# EAGLE design pwr-driver (EAGLE 7.1.0)
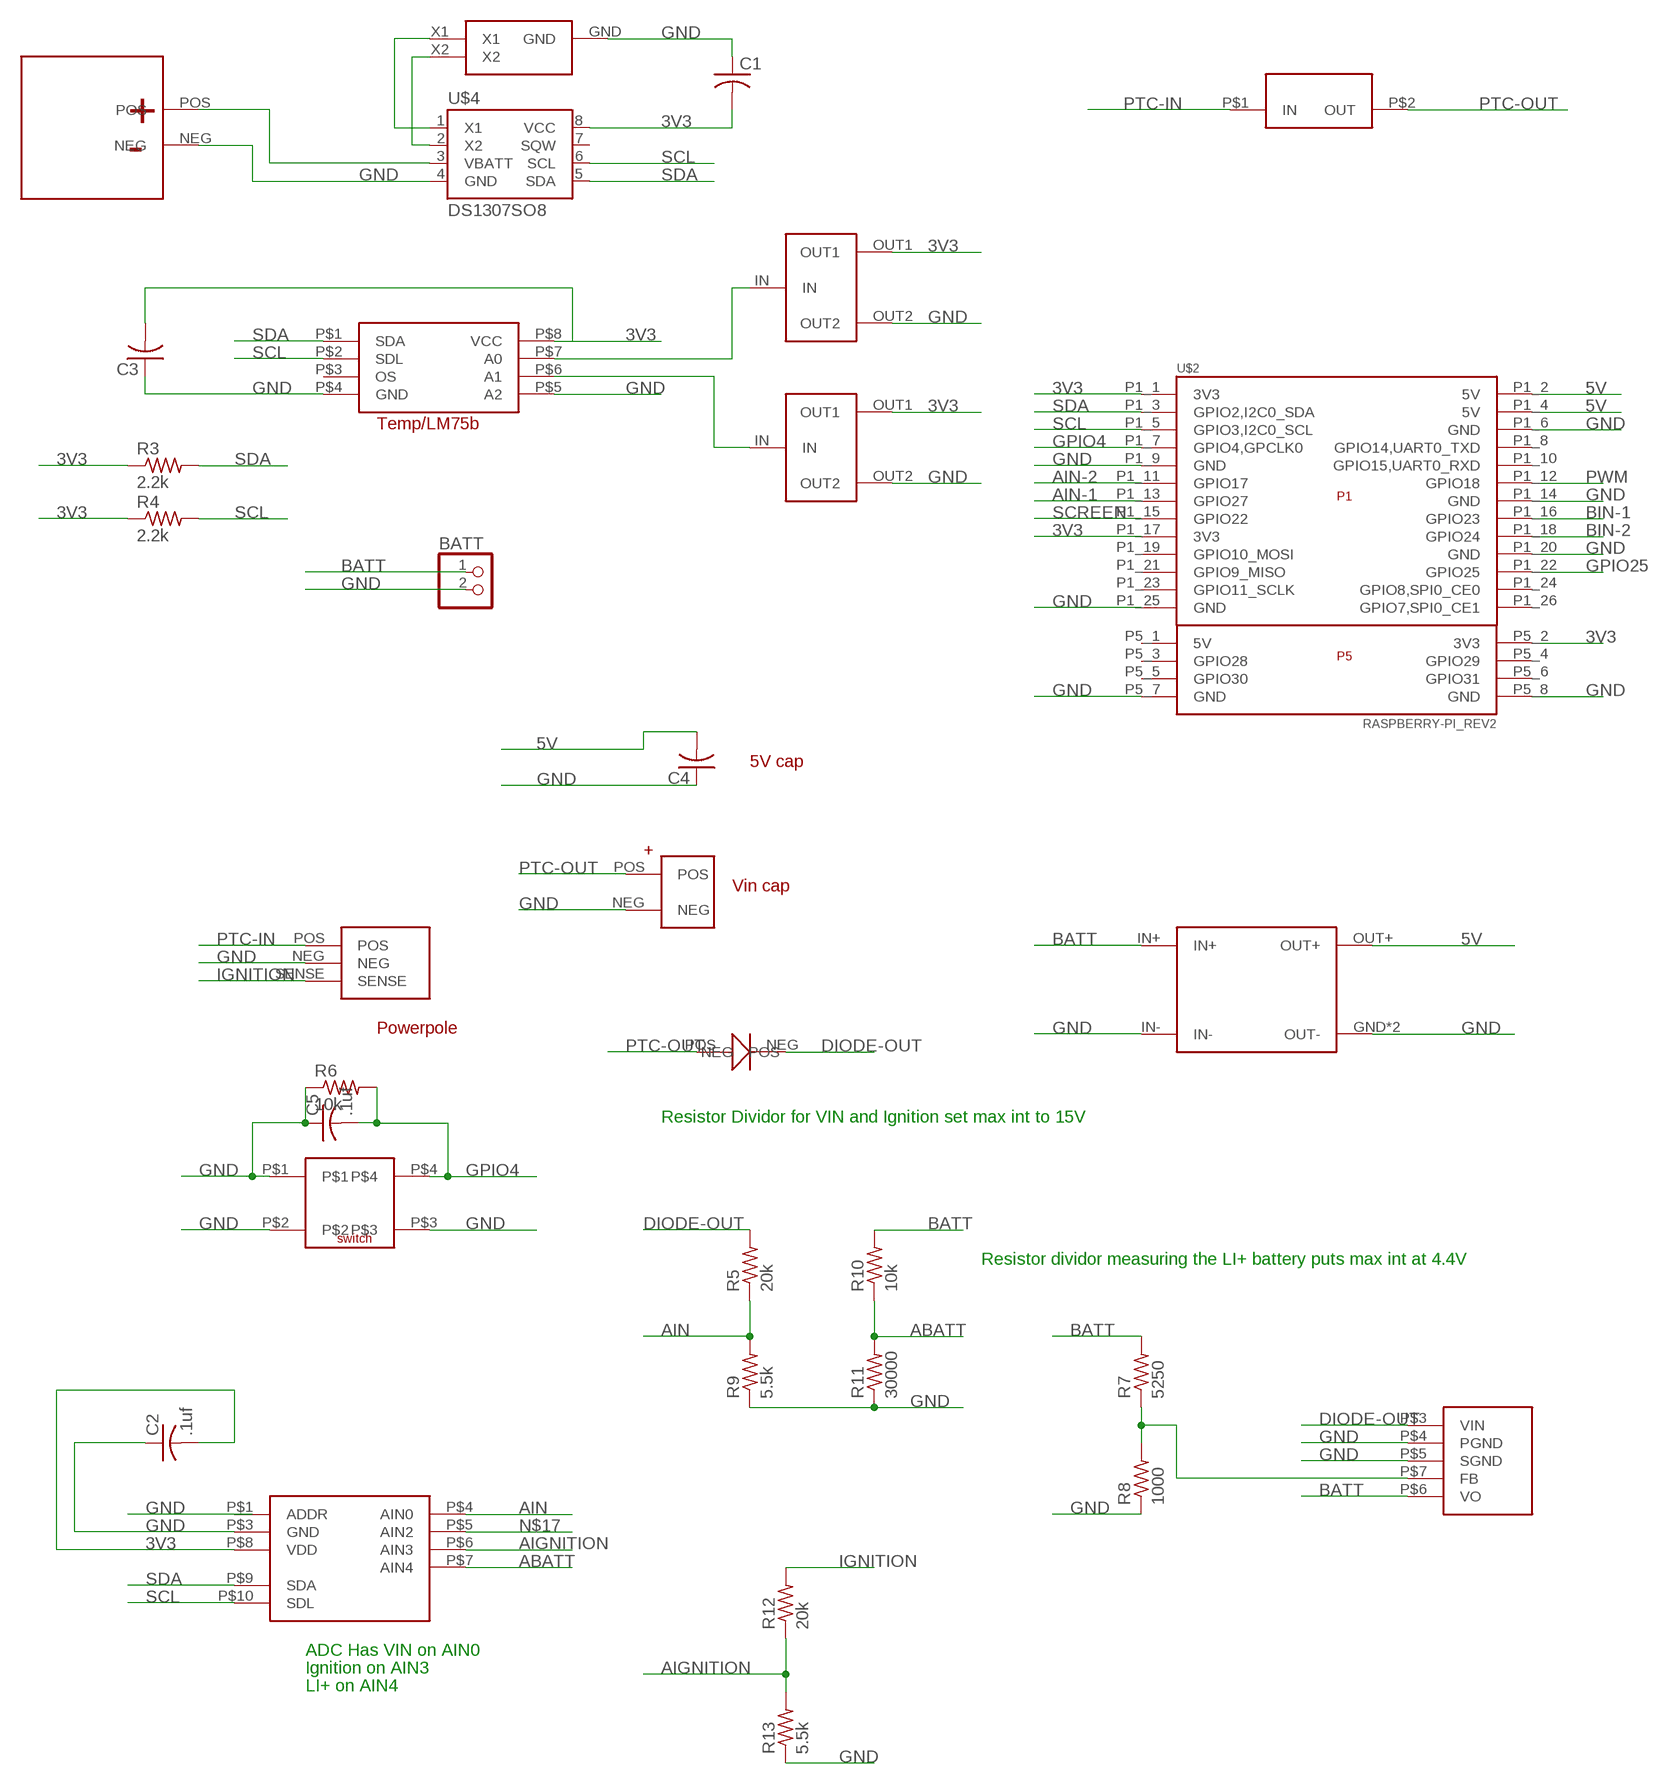
[diagram p0: schematic, sheet 1]

## Parts
BATT  PINHD-1X2  [1X02]
C1  C-USC0805K  [C0805K]
C2  .1uf  C-USC0603  [C0603]
C3  C-USC0805  [C0805]
C4  C-USC3216  [C3216]
C5  .1uf  C-USC0603  [C0603]
R3  2.2k  R-US_R0603  [R0603]
R4  2.2k  R-US_R0603  [R0603]
R5  20k  R-US_R0603  [R0603]
R6  10k  R-US_R0603  [R0603]
R7  5250  R-US_R0603  [R0603]
R8  1000  R-US_R0603  [R0603]
R9  5.5k  R-US_R0603  [R0603]
R10  10k  R-US_R0603  [R0603]
R11  30000  R-US_R0603  [R0603]
R12  20k  R-US_R0603  [R0603]
R13  5.5k  R-US_R0603  [R0603]
U$1  MPM80  [TO-220-8L]
U$2  RASPBERRY-PI_REV2  [RASPBERRY-PI_REV2]
U$3  STEP-UP-FROM-AMAZON  [STEP-UP-FROM-AMAZON]
U$4  DS1307SO8  [SO08]
U$5  BATTERY-MS518SE  [BATTERY-MS518SE-FL35E]
U$6  AB26T-CRYSTAL  [AB26T-CRYSTAL]
U$7  POWERPOLE-WITH-SENSE  [POWERPOLE-3]
U$8  PTC  [PTC-0ZRM0100FF1E]
U$9  LM75-BDP-TEMP  [TSSOP8]
U$10  ADS1013  [MSOP-10]
U$11  CAP-SMD-100U  [CAP-100UF-SMD]
U$12  0805-3-WAY  [0805-3-WAY]
U$13  0805-3-WAY  [0805-3-WAY]
U$14  MICRO-SWITCH  [BUTTON-MICRO-SWITCH]
U$15  DIODE-403  [403]

## Nets
3V3: C1.2 C2.2 C3.2 R3.1 R4.1 U$2.P1_1(3V3) U$2.P1_17(3V3) U$2.P5_2(3V3) U$4.8(VCC) U$9.P$8(VCC) U$10.P$8(VDD) U$12.OUT1 U$13.OUT1
5V: C4.2 U$2.P1_2(5V) U$2.P1_4(5V) U$3.OUT+
ABATT: R10.1 R11.2 U$10.P$7(AIN4)
AIGNITION: R12.1 R13.2 U$10.P$6(AIN3)
AIN: R5.1 R9.2 U$10.P$4(AIN0)
AIN-1: U$2.P1_13(GPIO27)
AIN-2: U$2.P1_11(GPIO17)
BATT: BATT.1 R7.2 R10.2 U$1.P$6(VO) U$3.IN+
BIN-1: U$2.P1_16(GPIO23)
BIN-2: U$2.P1_18(GPIO24)
DIODE-OUT: R5.2 U$1.P$3(VIN) U$15.NEG
GND: BATT.2 C1.1 C2.1 C3.1 C4.1 C5.1 R6.1 R8.1 R9.1 R11.1 R13.1 U$1.P$4(PGND) U$1.P$5(SGND) U$2.P1_6(GND) U$2.P1_9(GND) U$2.P1_14(GND) U$2.P1_20(GND) U$2.P1_25(GND) U$2.P5_7(GND) U$2.P5_8(GND) U$3.GND(OUT-) U$3.IN- U$3.OUT- U$4.4(GND) U$5.NEG U$6.GND U$7.NEG U$9.P$4(GND) U$9.P$5(A2) U$10.P$3(GND) U$11.NEG U$12.OUT2 U$13.OUT2 U$14.P$1 U$14.P$2 U$14.P$3
GPIO4: C5.2 R6.2 U$2.P1_7(GPIO4,GPCLK0) U$14.P$4
GPIO25: U$2.P1_22(GPIO25)
IGNITION: R12.2 U$7.SENSE
N$1: U$4.3(VBATT) U$5.POS
N$2: U$4.2(X2) U$6.X2
N$3: U$4.1(X1) U$6.X1
N$4: R7.1 R8.2 U$1.P$7(FB)
N$7: U$9.P$7(A0) U$12.IN
N$9: U$9.P$6(A1) U$13.IN
N$17: U$10.P$5(AIN2)
PTC-IN: U$7.POS U$8.P$1(IN)
PTC-OUT: U$8.P$2(OUT) U$11.POS U$15.POS
PWM: U$2.P1_12(GPIO18)
SCL: R4.2 U$2.P1_5(GPIO3,I2C0_SCL) U$4.6(SCL) U$9.P$2(SDL) U$10.P$10(SDL)
SCREEN: U$2.P1_15(GPIO22)
SDA: R3.2 U$2.P1_3(GPIO2,I2C0_SDA) U$4.5(SDA) U$9.P$1(SDA) U$10.P$9(SDA)
Unconnected: U$2.P1_8(GPIO14,UART0_TXD) U$2.P1_10(GPIO15,UART0_RXD) U$2.P1_19(GPIO10_MOSI) U$2.P1_21(GPIO9_MISO) U$2.P1_23(GPIO11_SCLK) U$2.P1_24(GPIO8,SPI0_CE0) U$2.P1_26(GPIO7,SPI0_CE1) U$2.P5_1(5V) U$2.P5_3(GPIO28) U$2.P5_4(GPIO29) U$2.P5_5(GPIO30) U$2.P5_6(GPIO31) U$4.7(SQW) U$9.P$3(OS) U$10.P$1(ADDR)

## Notes on the sheet
- 5V cap
- Vin cap
- Powerpole
- Resistor Dividor for VIN and Ignition set max int to 15V
- Resistor dividor measuring the LI+ battery puts max int at 4.4V
- ADC Has VIN on AIN0
- Ignition on AIN3
- LI+ on AIN4

## Library data of the parts
BATT = pinhead:PINHD-1X2: PIN HEADER
C1-C5 = resistor:C-US: CAPACITOR, American symbol
R3-R13 = resistor:R-US_: RESISTOR, American symbol
U$1 = needed-parts:MPM80
U$2 = RaspberryPi:RASPBERRY-PI_REV2: Raspberry Pi Board <http://www.raspberrypi.org/> Jacques Lagnel V1.0 (beta) 2012 Mateusz Bawaj V1.1 (beta) 2012 Board dimension: Forum 3D model <http://www.raspberrypi.org/forum/general-discussion/mechanical-profile-3d-models?value=3d%20model&type=1&include=1&search=1&ret=all> The GPIO Connector (P1): http://elinux.org/RPi_Low-level_peripherals The GPIO Connector (P5): http://www.raspberrypi-spy.co.uk/2012/09/raspberry-pi-p5-header/
U$3 = needed-parts:STEP-UP-FROM-AMAZON
U$4 = mgregg:DS1307
U$5 = mgregg:BATTERY-MS518SE
U$6 = mgregg:AB26T-CRYSTAL
U$7 = needed-parts:POWERPOLE-WITH-SENSE
U$8 = needed-parts:PTC
U$9 = mgregg:LM75-BDP-TEMP
U$10 = needed-parts:ADS1013
U$11 = mgregg:CAP-SMD-100U: http://www.mouser.com/Search/ProductDetail.aspx?R=VEJ-101M1ETR-0607virtualkey14000000virtualkey140-VEJ101M1ETR0607
U$12 U$13 = mgregg:0805-3-WAY
U$14 = mgregg:MICRO-SWITCH
U$15 = needed-parts:DIODE-403

## Board
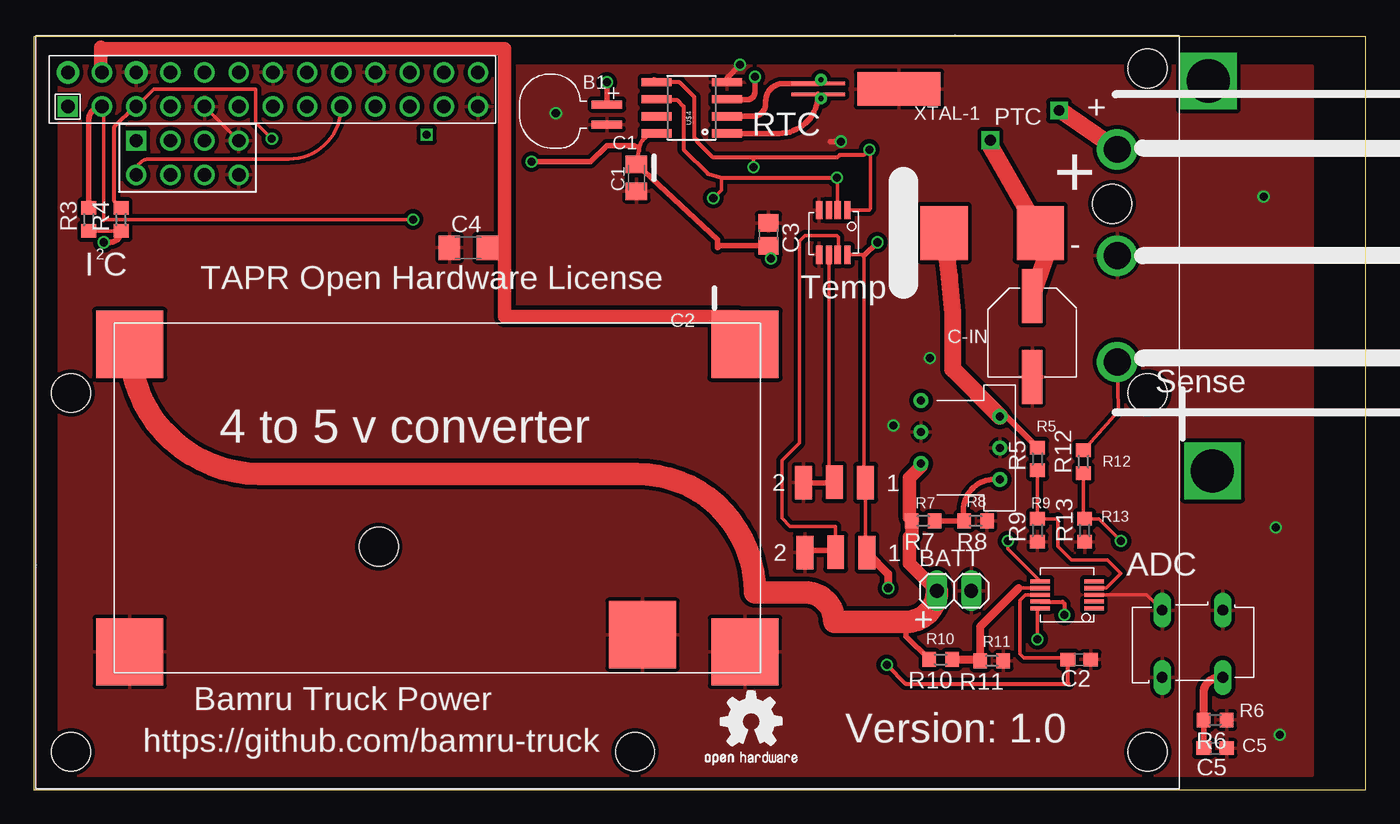
[diagram p1: board, top side]
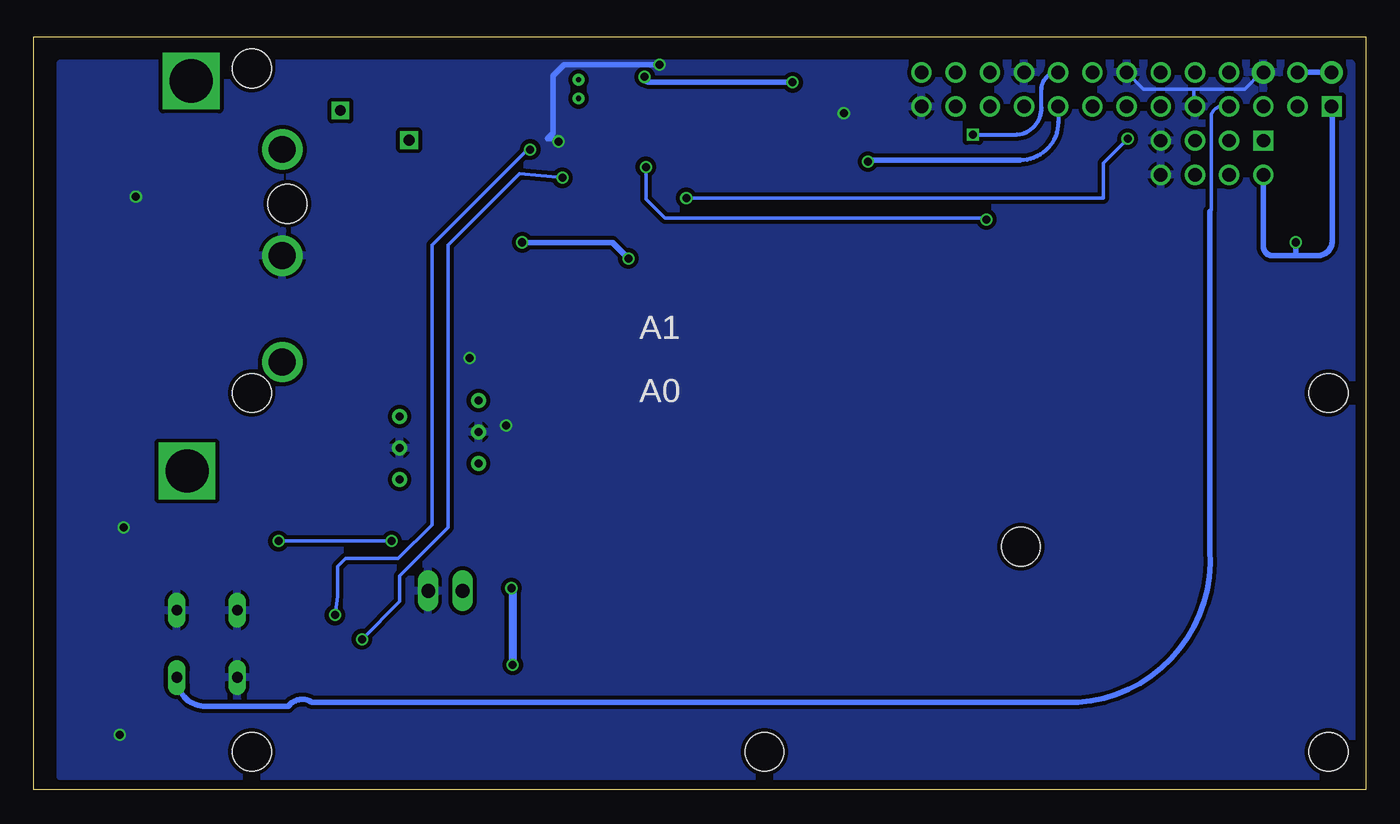
[diagram p2: board, bottom side, seen from below]

Size 99 x 56 mm. Coordinates in mm from the lower left corner, seen from the top.
Outline: 0,0 99,0 99,56 0,56 0,0
Copper layers (1*16): Top 0.035mm / dielectric 1.5mm / Bottom 0.035mm
Design rules "SeeedStudio_2layer_DRU_no_angle_20140221": minimum track width 6mil, minimum drill 12mil, track to track 6mil, track to pad 6mil, pad to pad 6mil, via to via 6mil, smd to smd 0mil, copper to edge 10mil, drill to drill 10mil, minimum pad ring 10mil, minimum via ring 6mil, stop-mask expansion 2mil, vias tented up to drill 100mil, thermal gap 10mil

### Footprints (pad centres in the part's own frame; a part is rotated, then mirrored left to right if it is on the bottom)
1X02 = drill 1.016 long: 1 -1.27,0; 2 1.27,0
C0805K = smd 1.3 x 1.6: 1 -1,0; 2 1,0
C0603 = smd 1.1 x 1: 1 -0.85,0; 2 0.85,0
C0805 = smd 1.3 x 1.5: 1 -0.85,0; 2 0.85,0
C3216 = smd 1.6 x 1.8: 1 -1.4,0; 2 1.4,0
R0603 = smd 1 x 1.1: 1 -0.85,0; 2 0.85,0
TO-220-8L = drill 0.6: P$2 2.34,5.85; P$3 1.17,0; P$4 0,5.85; P$5 -1.17,0; P$6 -2.34,5.85; P$7 -3.51,0
RASPBERRY-PI_REV2 = drill 1 square: P1_1 -41.91,21.59; P5_1 -36.83,19.05 | drill 1 pad 1.676: P1_2 -41.91,24.13; P1_6 -36.83,24.13 | drill 1: P1_3 -39.37,21.59; P1_4 -39.37,24.13; P1_5 -36.83,21.59; P1_7 -34.29,21.59; P1_8 -34.29,24.13; P1_9 -31.75,21.59; P1_10 -31.75,24.13; P1_11 -29.21,21.59; P1_12 -29.21,24.13; P1_13 -26.67,21.59; P1_14 -26.67,24.13; P1_15 -24.13,21.59; P1_16 -24.13,24.13; P1_17 -21.59,21.59; P1_18 -21.59,24.13; P1_19 -19.05,21.59; P1_20 -19.05,24.13; P1_21 -16.51,21.59; P1_22 -16.51,24.13; P1_23 -13.97,21.59; P1_24 -13.97,24.13; P1_25 -11.43,21.59; P1_26 -11.43,24.13; P5_2 -36.83,16.51; P5_3 -34.29,19.05; P5_4 -34.29,16.51; P5_5 -31.75,19.05; P5_6 -31.75,16.51; P5_7 -29.21,19.05; P5_8 -29.21,16.51 | hole 2.9: 35.69,14.365; -18.81,-11.135; -41.67,-26.375; 0.24,-26.375; 38.34,-26.375; 38.34,0.295; 38.34,24.425; -41.67,0.295
STEP-UP-FROM-AMAZON = smd 5 x 5: GND 15.24,-10.16; IN+ -22.86,11.43; IN- -22.86,-11.43; OUT+ 22.86,11.43; OUT- 22.86,-11.43
SO08 = smd 0.61 x 2.21: 1 -1.905,-2.616; 2 -0.635,-2.616; 3 0.635,-2.616; 4 1.905,-2.616; 5 1.905,2.616; 6 0.635,2.616; 7 -0.635,2.616; 8 -1.905,2.616
BATTERY-MS518SE-FL35E = smd 2.25 x 0.6: NEG 5,0.25; POS 5,1.75
AB26T-CRYSTAL = smd 6.2 x 2.5: GND -2,0.4 | drill 0.381: P$1 3.8,1.1; P$2 3.8,-0.3 | smd 4 x 0.25: X1 4,0.8; X2 4,0
POWERPOLE-3 = drill 2: NEG -0.28,3.81; POS -0.28,11.71; SENSE -0.28,-4.09
PTC-0ZRM0100FF1E = drill 0.8 square: P$1 0,0; P$2 5.1,2.2
TSSOP8 = smd 1.35 x 0.45: P$1 0,1.375; P$2 0,0.65; P$3 0,0; P$4 0,-0.725; P$5 3.325,-0.725; P$6 3.325,0; P$7 3.325,0.65; P$8 3.325,1.375
MSOP-10 = smd 0.3 x 1.45: P$1 0,-2; P$2 0.5,-2; P$3 1,-2; P$4 1.5,-2; P$5 2,-2; P$6 2,2; P$7 1.5,2; P$8 1,2; P$9 0.5,2; P$10 0,2
CAP-100UF-SMD = smd 4 x 1.5: NEG 0,3.3; POS 6,3.3
0805-3-WAY = smd 1.25 x 2.5: IN 1.1,-0.43; OUT1 3.42,-0.46; OUT2 -1.19,-0.46
BUTTON-MICRO-SWITCH = drill 0.8 long: P$1 -2.54,2.46; P$2 1.96,2.46; P$3 -2.54,-2.54; P$4 1.96,-2.54
403 = smd 3.5 x 4: NEG -7.137,0; POS 0,0

### Placement (x,y rotation side)
BATT  68.4,14.8 0 top
C1  44.8,45.5 90 top
C2  77.7,9.7 180 top
C3  54.6,41.3 270 top
C4  32.3,40.3 0 top
C5  87.8,3.1 180 top
R3  4.1,42.4 90 top
R4  6.5,42.4 90 top
R5  74.6,24.6 90 top
R6  87.8,5.2 180 top
R7  66.1,20 180 top
R8  70,20 180 top
R9  74.6,19.3 90 top
R10  67.4,9.7 180 top
R11  71.2,9.6 180 top
R12  78,24.4 90 top
R13  78.1,19.3 90 top
U$1  71.8,26.6 90 top
U$2  44.45,29.21 0 top
U$3  30,21.7 0 top
U$4  48.9,50.7 90 top
U$5  37.6,49.2 0 top
U$6  62.3,52.5 180 top
U$7  80.8,35.9 0 top
U$8  76.2,50.5 180 top
U$9  59.1,43.1 270 top
U$10  76.8,13.5 90 top
U$11  77.5,30.7 90 top
U$12  58.5,18.1 0 top
U$13  58.4,23.3 0 top
U$14  86.4,10.9 0 top
U$15  74.8,41.4 0 top
U$16  [OSHW2]  49.5,0.8 0 top

### Tracks (layer width: path | path; a pad name or v marks a point on that pad's centre or on a via)
3V3  (via drill 0.6)
  Top 0.254: R3.1 R4.1 | U$2.P5_2 7.62,45.92 arc-90 8.6,46.9 18.96,46.9 arc90 U$2.P1_17 | U$12.OUT1 61.82,17.74 U$13.OUT1 61.7,22.96 61.7,39.7 61.62,39.77 U$9.P$8 | C2.2 76.75,9.8 73.6,9.8 73.3,10.1 73.3,14.1 73.7,14.5 U$10.P$8
  Top 0.305: C1.2 45,47.51 | 45,47.51 arc-90 U$4.8 | 44.61,47.9 arc-90 45,47.51 | v63.4,9.3 64.8,7.9 76.9,7.9 76.85,7.95 C2.2
  Top 0.406: R4.1 arc-90 5.65,40.7 v5.2,40.7 | C1.2 50.8,40.9 50.8,40.3 50.95,40.45 C3.2 54.8,40.25 v54.8,39.5 | v62.7,40.7 61.7,39.7 | 44.61,47.9 42.6,47.9 41.4,46.7 v37,46.7
  Top 0.61: U$12.OUT1 63.5,16.06 v63.5,15
  Bottom 0.305: U$2.P1_17 22.86,49.64 arc90 25.7,46.8
  Bottom 0.406: U$2.P5_2 7.62,40.42 arc-90 6.9,39.7 5.2,39.7 | 5.2,39.7 3.6,39.7 arc-90 2.5,40.8 2.5,50.76 arc-90 U$2.P1_1 | v5.2,40.7 5.2,39.7 | v54.8,39.5 56,40.7 v62.7,40.7 | v37,46.7 36.9,46.8 25.7,46.8
  Bottom 0.61: v63.5,15 63.4,14.9 v63.4,9.3
5V
  Top 1.016: U$3.OUT+ 52.29,35.2 35,35.2 35,40.4 | U$2.P1_4 5,53.42 5,55.2 5.1,55.1 35,55.1 35,40.4 | C4.2 34.6,40.4 35,40.4
  Bottom 0.406: U$2.P1_4 U$2.P1_2
ABATT
  Top 0.254: 73.2,15 U$10.P$7
  Top 0.61: R10.1 70.25,9.7 R11.2 70.35,12.15 73.2,15
AIGNITION  (via drill 0.6)
  Top 0.254: U$10.P$6 72.4,17.9 v72.4,18.5 | v80.8,18.5 79.15,20.15 R13.2 78,20.25 R12.1
  Bottom 0.254: v72.4,18.5 v80.8,18.5
AIN
  Top 0.254: U$10.P$4 79.7,15 80.8,16.1 79.8,17.1 77.1,17.1 76.1,18.1 76.1,20.2 76.05,20.15 R9.2 R5.1
BATT
  Top 0.406: 65.3,20.05 arc-90 R7.2 | R10.2 64.83,11.42 64.83,12.5
  Top 1.016: BATT.1 65.1,16.83 65.1,18.8 65.25,18.95 R7.2 | 65.3,20.05 65.1,20.25 65.1,23.2 65.95,24.05 U$1.P$6
  Top 1.676: BATT.1 arc-90 64.83,12.5 59.5,12.5 arc90 57.3,14.7 53.6,14.7 arc90 44.8,23.5 16.77,23.5 arc-90 U$3.IN+
BIN-2  (via drill 0.6)
  Bottom 0.305: v29.2,48.7 26.1,48.7 arc-90 24.1,50.7 24.1,52.1 arc90 U$2.P1_18
DIODE-OUT
  Top 0.406: R5.2 72.28,27.77 U$1.P$3
  Top 1.27: U$1.P$3 68.3,31.27 68.3,35.5 68.06,38.16 U$15.NEG
GND  (via drill 0.6)
  Top 0.254: U$2.P1_9 U$2.P5_7 | U$10.P$3 82.72,14.5 U$14.P$1
  Top 0.406: 59.2,48.2 v60,48.2 | v52.5,53.9 51.52,52.92 U$4.4
  Bottom 0.254: U$2.P1_6 7.76,53.34 9,52.1 16.54,52.1 U$2.P1_14
  Bottom 0.406: v60,48.2 60.2,48.4 60.8,48.4 60.4,48.8 60.4,53.1 59.6,53.9 v52.5,53.9
  other vias: 38.8,50.3 92.6,4.1 92.3,19.5 91.4,44.1 63.9,27.1 66.6,32.1
  pour Top (isolate 0.305): 95,1.1 95,53.8 1.9,53.8 1.9,1.1
  pour Bottom (isolate 0.305): 1.1,1 97,1 97,54 1.1,54
GPIO4
  Top 0.406: C5.2 R6.2
  Top 0.61: R6.2 86.95,7.35 arc-90 U$14.P$4
  Bottom 0.254: U$2.P1_7 10.7,50.8 arc-90 11.5,50 11.5,43.1 arc90 11.6,43
  Bottom 0.406: 11.6,43 11.6,17.8 arc90 21.4,6.5 78.3,6.5 arc-90 80.1,6.2 86.2,6.2 arc90 U$14.P$4
IGNITION
  Top 0.254: R12.2 80.62,28.17 U$7.SENSE
N$1  (via drill 0.6)
  Top 0.406: U$4.3 arc90 51.55,51.3 53,51.3 arc90 53.6,51.9 v53.6,53 | v42.6,52.6 U$5.POS
  Bottom 0.406: v53.6,53 arc-90 53.2,52.6 v42.6,52.6
N$2
  Top 0.406: U$6.X2 55.7,52.5 arc90 54.4,51.2 54.4,51 arc-90 53.47,50.06 U$4.2
N$3
  Top 0.406: U$6.X1 arc-90 55.4,48.8 U$4.1
N$4
  Top 0.406: R7.1 R8.2 arc-90 69.1,20.05 69.1,20.8 arc-90 71.39,23.09 U$1.P$7
N$5
  Top 0.406: 57.5,17.8 59.7,17.8
N$6
  Top 0.406: 59.5,22.8 57.3,22.8
N$7
  Top 0.254: U$9.P$7 59.8,39.83 59.8,41.1 59.7,41.2 57.3,41.2 56.9,40.8 56.9,25.8 55.6,24.5 55.6,20.2 56.2,19.6 59.6,19.6 U$12.IN
N$8
  Bottom 0.254: 12.8,50.6 12.8,52
N$9
  Top 0.254: U$13.IN 59.1,23.27 U$9.P$6
N$12  (via drill 3.2)
  other vias: 87.6,23.7
N$13  (via drill 3.2)
  other vias: 87.3,52.7
PTC-IN
  Top 1.27: U$7.POS 76.33,50.5 U$8.P$1
PTC-OUT
  Top 1.27: U$11.POS 75.8,41.3 U$15.POS 71.1,47.9 U$8.P$2
SCL  (via drill 0.6)
  Top 0.254: U$10.P$10 74.6,13.3 v74.6,11.2 | v59.7,45.5 59.75,45.75 U$9.P$2 | U$2.P1_5 8.92,52.1 16.5,52.1 16.5,49.6 v17.7,48.4 | v50.5,44 51.1,44.6 51.1,45.5
  Top 0.305: R4.2 6,43.75 6,49.3 7.5,50.8 U$2.P1_5 | U$4.6 46.32,51.3 47.8,51.3 48.3,50.8 48.3,47.6 50.1,45.8 51.1,45.5 v59.7,45.5
  Bottom 0.254: v74.6,11.2 71.8,14 71.8,15.9 68.2,19.5 68.2,40.5 62.9,45.8 v59.7,45.5 | v17.7,48.4 19.5,46.6 19.5,44 v50.5,44
SDA  (via drill 0.6)
  Top 0.254: v62.1,47.6 62.2,47.5 62.2,43.2 62.1,43.1 U$9.P$1 | U$2.P1_3 5.2,50.68 5.2,42.3 5.3,42.4 v28.2,42.4 | v53.5,46.3 53.5,47
  Top 0.305: v62.1,47.6 61.7,47.2 59.9,47.2 59.7,47 53.5,47 50.5,47 49.3,48.2 49.3,48.3 49.1,48.5 49.1,51.5 47.99,52.6 U$4.5 | U$10.P$9 74.82,13.98 76.46,13.98 76.6,13.84 v76.6,13
  Top 0.406: U$2.P1_3 arc90 4.1,49.82 R3.2 | U$4.5 46.1,52.79
  Bottom 0.254: v76.6,13 76.4,14.4 76.4,16.6 75.8,17.2 71.9,17.2 69.4,19.7 69.4,40.5 62.3,47.6 v62.1,47.6 | v28.2,42.4 28.3,42.5 52.1,42.5 53.5,43.9 v53.5,46.3

### Text on the board
tPlace: B1 | XTAL-1 | RTC | C1 | + | 2 | I C | TAPR Open Hardware License | Temp | C2 | C-IN | R5 | 4 to 5 v converter | R12 | R7 | R8 | R9 | R13 | ADC | + | R10 | R11 | Bamru Truck Power | R6 | Version: 1.0 | https://github.com/bamru-truck | C5
bPlace: A1 | A0